# Altium schematic sheet Sheet2.SchDoc
size A
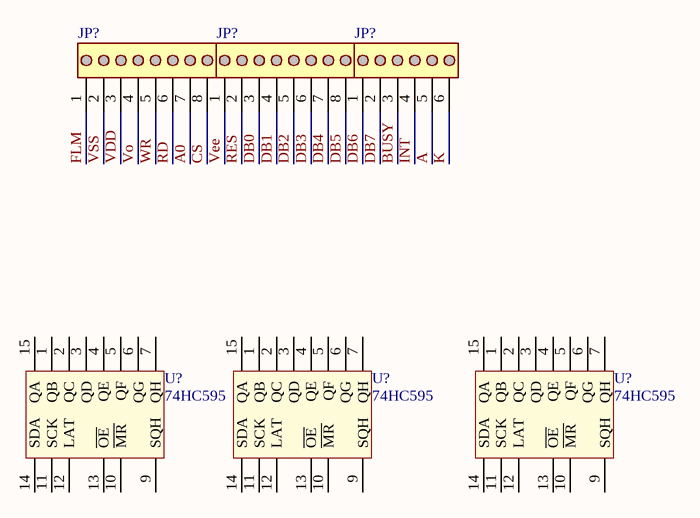
[diagram p0: Sheet2.SchDoc]

## Parts
(Parts that share a designator on the sheet are numbered #1, #2 ... from top to bottom, then left to right.)
JP?#1  Jumper 8x1  [JP8]  (value not drawn)
JP?#2  Jumper 8x1  [JP8]  (value not drawn)
JP?#3  Jumper 6x1  [JP6]  (value not drawn)
U?#1  74HC595  [DIP16]
U?#2  74HC595  [DIP16]
U?#3  74HC595  [DIP16]

## Nets
GND: U?#1.8 U?#2.8 U?#3.8
VCC: U?#1.16 U?#2.16 U?#3.16
A: JP?#3.5
A0: JP?#1.7
BUSY: JP?#3.3
CS: JP?#1.8
DB0: JP?#2.3
DB1: JP?#2.4
DB2: JP?#2.5
DB3: JP?#2.6
DB4: JP?#2.7
DB5: JP?#2.8
DB6: JP?#3.1
DB7: JP?#3.2
FLM: JP?#1.1
INT: JP?#3.4
K: JP?#3.6
RD: JP?#1.6
RES: JP?#2.2
VDD: JP?#1.3
Vee: JP?#2.1
Vo: JP?#1.4
VSS: JP?#1.2
WR: JP?#1.5

Not connected (* = marked no-connect by the designer): U?#1 1(QB) 2(QC) 3(QD) 4(QE) 5(QF) 6(QG) 7(QH) 9(SQH) 10(~{MR}) 11(SCK) 12(LAT) 13(~{OE}) 14(SDA) 15(QA); U?#2 1(QB) 2(QC) 3(QD) 4(QE) 5(QF) 6(QG) 7(QH) 9(SQH) 10(~{MR}) 11(SCK) 12(LAT) 13(~{OE}) 14(SDA) 15(QA); U?#3 1(QB) 2(QC) 3(QD) 4(QE) 5(QF) 6(QG) 7(QH) 9(SQH) 10(~{MR}) 11(SCK) 12(LAT) 13(~{OE}) 14(SDA) 15(QA)